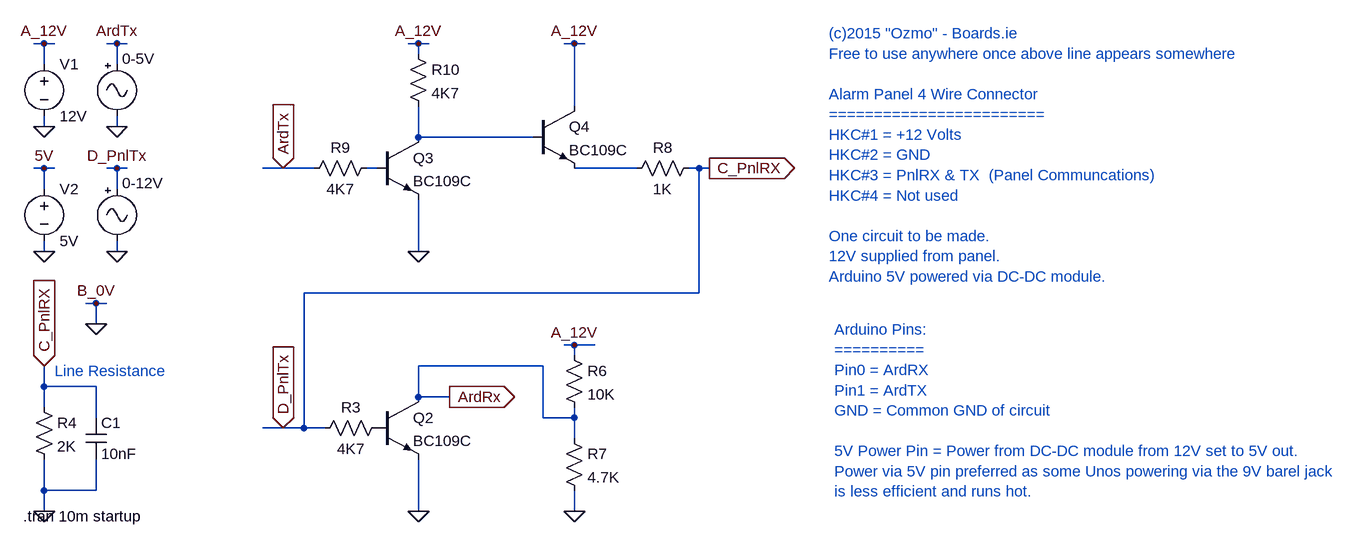
[diagram p0: schematic ArdTx Final Soln V2_CustomLib.asc]
ArdTx Final Soln V2_CustomLib.asc, the LTspice schematic file:
Version 4
SHEET 1 1852 1320
WIRE -1296 400 -1312 400
WIRE -1280 400 -1296 400
WIRE -1184 400 -1200 400
WIRE -1168 400 -1184 400
WIRE -720 400 -736 400
WIRE -704 400 -720 400
WIRE -480 400 -496 400
WIRE -464 400 -480 400
WIRE -720 416 -720 400
WIRE -1296 432 -1296 400
WIRE -1184 432 -1184 400
WIRE -480 496 -480 400
WIRE -1296 528 -1296 512
WIRE -1184 528 -1184 512
WIRE -720 544 -720 496
WIRE -544 544 -720 544
WIRE -1296 592 -1312 592
WIRE -1280 592 -1296 592
WIRE -1184 592 -1200 592
WIRE -1168 592 -1184 592
WIRE -928 592 -960 592
WIRE -880 592 -928 592
WIRE -784 592 -800 592
WIRE -384 592 -480 592
WIRE -288 592 -304 592
WIRE -272 592 -288 592
WIRE -1296 624 -1296 592
WIRE -1184 624 -1184 592
WIRE -1296 720 -1296 704
WIRE -1184 720 -1184 704
WIRE -720 720 -720 640
WIRE -288 784 -288 592
WIRE -288 784 -896 784
WIRE -1216 800 -1232 800
WIRE -1200 800 -1216 800
WIRE -1216 832 -1216 800
WIRE -480 864 -496 864
WIRE -448 864 -480 864
WIRE -480 880 -480 864
WIRE -528 896 -720 896
WIRE -1296 928 -1296 896
WIRE -1216 928 -1296 928
WIRE -720 944 -720 896
WIRE -672 944 -720 944
WIRE -1296 960 -1296 928
WIRE -1216 976 -1216 928
WIRE -528 976 -528 896
WIRE -480 976 -480 960
WIRE -480 976 -528 976
WIRE -928 992 -960 992
WIRE -896 992 -896 784
WIRE -896 992 -928 992
WIRE -864 992 -896 992
WIRE -480 1008 -480 976
WIRE -1296 1088 -1296 1040
WIRE -1216 1088 -1216 1040
WIRE -1216 1088 -1296 1088
WIRE -1296 1120 -1296 1088
WIRE -720 1120 -720 1040
WIRE -480 1120 -480 1088
FLAG -1296 400 A_12V
FLAG -1296 528 0
FLAG -1184 400 ArdTx
FLAG -1184 528 0
FLAG -1184 592 D_PnlTx
FLAG -1184 720 0
FLAG -928 992 D_PnlTx
IOPIN -928 992 In
FLAG -672 944 ArdRx
IOPIN -672 944 Out
FLAG -1296 1120 0
FLAG -720 1120 0
FLAG -1296 896 C_PnlRX
IOPIN -1296 896 In
FLAG -1296 592 5V
FLAG -1296 720 0
FLAG -1216 832 0
FLAG -1216 800 B_0V
FLAG -480 1120 0
FLAG -480 864 A_12V
FLAG -272 592 C_PnlRX
IOPIN -272 592 Out
FLAG -720 720 0
FLAG -928 592 ArdTx
IOPIN -928 592 In
FLAG -720 400 A_12V
FLAG -480 400 A_12V
SYMBOL res -1312 944 R0
SYMATTR InstName R4
SYMATTR Value 2K
SYMATTR SpiceLine tol=1 pwr=0.1
SYMBOL Misc\\signal -1184 416 R0
WINDOW 3 24 104 Invisible 2
WINDOW 123 0 0 Left 2
WINDOW 39 0 0 Left 2
WINDOW 0 8 7 Left 2
SYMATTR Value PULSE(0 5 0 .000001 .000001 .0006 .0012 100)
SYMATTR InstName 0-5V
SYMBOL cap -1232 976 R0
SYMATTR InstName C1
SYMATTR Value 10nF
SYMBOL voltage -1296 416 R0
WINDOW 123 0 0 Left 2
WINDOW 39 0 0 Left 2
SYMATTR InstName V1
SYMATTR Value 12V
SYMBOL npn -784 944 R0
SYMATTR InstName Q2
SYMATTR Value BC109C
SYMBOL Misc\\signal -1184 608 R0
WINDOW 3 24 104 Invisible 2
WINDOW 123 0 0 Left 2
WINDOW 39 0 0 Left 2
WINDOW 0 8 7 Left 2
SYMATTR Value PULSE(0 12 0 .000001 .000001 0.0006 .0012 10000)
SYMATTR InstName 0-12V
SYMBOL res -768 976 R90
WINDOW 0 0 56 VBottom 2
WINDOW 3 32 56 VTop 2
SYMATTR InstName R3
SYMATTR Value 4K7
SYMATTR SpiceLine tol=1 pwr=0.1
SYMBOL res -496 864 R0
SYMATTR InstName R6
SYMATTR Value 10K
SYMATTR SpiceLine tol=1 pwr=0.1
SYMBOL voltage -1296 608 R0
WINDOW 123 0 0 Left 2
WINDOW 39 0 0 Left 2
SYMATTR InstName V2
SYMATTR Value 5V
SYMBOL res -496 992 R0
SYMATTR InstName R7
SYMATTR Value 4.7K
SYMATTR SpiceLine tol=1 pwr=0.1
SYMBOL res -784 576 R90
WINDOW 0 0 56 VBottom 2
WINDOW 3 32 56 VTop 2
SYMATTR InstName R9
SYMATTR Value 4K7
SYMATTR SpiceLine tol=1 pwr=0.1
SYMBOL NPN -784 544 R0
SYMATTR InstName Q3
SYMATTR Value BC109C
SYMBOL res -736 400 R0
SYMATTR InstName R10
SYMATTR Value 4K7
SYMATTR SpiceLine tol=1 pwr=0.1
SYMBOL NPN -544 496 R0
SYMATTR InstName Q4
SYMATTR Value BC109C
SYMBOL res -288 576 R90
WINDOW 0 0 56 VBottom 2
WINDOW 3 32 56 VTop 2
SYMATTR InstName R8
SYMATTR Value 1K
SYMATTR SpiceLine tol=1 pwr=0.1
TEXT -1328 1128 Left 2 !.tran 10m startup
TEXT -1280 904 Left 2 ;Line Resistance
TEXT -88 384 Left 2 ;(c)2015 "Ozmo" - Boards.ie\nFree to use anywhere once above line appears somewhere\n \nAlarm Panel 4 Wire Connector\n========================\nHKC#1 = +12 Volts\nHKC#2 = GND\nHKC#3 = PnlRX & TX  (Panel Communcations)\nHKC#4 = Not used\n \nOne circuit to be made.\n12V supplied from panel. \nArduino 5V powered via DC-DC module.
TEXT -80 840 Left 2 ;Arduino Pins:\n==========\nPin0 = ArdRX\nPin1 = ArdTX\nGND = Common GND of circuit\n \n5V Power Pin = Power from DC-DC module from 12V set to 5V out.\nPower via 5V pin preferred as some Unos powering via the 9V barel jack \nis less efficient and runs hot.

The netlist it stands for:
* ArdTx Final Soln V2_CustomLib.asc
R4 C_PnlRX 0 2K tol=1 pwr=0.1
V§0-5V ArdTx 0 PULSE(0 5 0 .000001 .000001 .0006 .0012 100)
C1 C_PnlRX 0 10nF
V1 A_12V 0 12V
Q2 ArdRx P001 0 0 BC109C
V§0-12V C_PnlRX 0 PULSE(0 12 0 .000001 .000001 0.0006 .0012 10000)
R3 P001 C_PnlRX 4K7 tol=1 pwr=0.1
R6 A_12V ArdRx 10K tol=1 pwr=0.1
V2 5V 0 5V
R7 ArdRx 0 4.7K tol=1 pwr=0.1
R9 N002 ArdTx 4K7 tol=1 pwr=0.1
Q3 N001 N002 0 0 BC109C
R10 A_12V N001 4K7 tol=1 pwr=0.1
Q4 A_12V N001 N003 0 BC109C
R8 C_PnlRX N003 1K tol=1 pwr=0.1
.model NPN NPN
.model PNP PNP
.lib standard.bjt
.tran 10m startup
* Line Resistance
* (c)2015 "Ozmo" - Boards.ie
* Free to use anywhere once above line appears somewhere
* Alarm Panel 4 Wire Connector
* ========================
* HKC#1 = +12 Volts
* HKC#2 = GND
* HKC#3 = PnlRX & TX  (Panel Communcations)
* HKC#4 = Not used
* One circuit to be made.
* 12V supplied from panel.
* Arduino 5V powered via DC-DC module.
* Arduino Pins:
* ==========
* Pin0 = ArdRX
* Pin1 = ArdTX
* GND = Common GND of circuit
* 5V Power Pin = Power from DC-DC module from 12V set to 5V out.
* Power via 5V pin preferred as some Unos powering via the 9V barel jack
* is less efficient and runs hot.
.backanno
.end